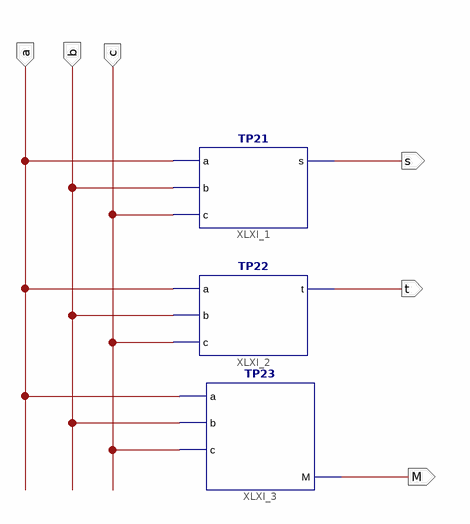
[diagram p0: schematic sheet 1]
// Xilinx ISE schematic toplevel.sch (spartan3e) as structural Verilog: 3 symbols, 6 ports
module toplevel (
  input  c,
  input  b,
  input  a,
  output s,
  output t,
  output M
);

  TP21 XLXI_1 (.a(a), .b(b), .c(c), .s(s));
  TP22 XLXI_2 (.a(a), .b(b), .c(c), .t(t));
  TP23 XLXI_3 (.a(a), .b(b), .c(c), .M(M));
endmodule
